# Altium schematic sheet Sheet1.SchDoc (part 2 of 2)
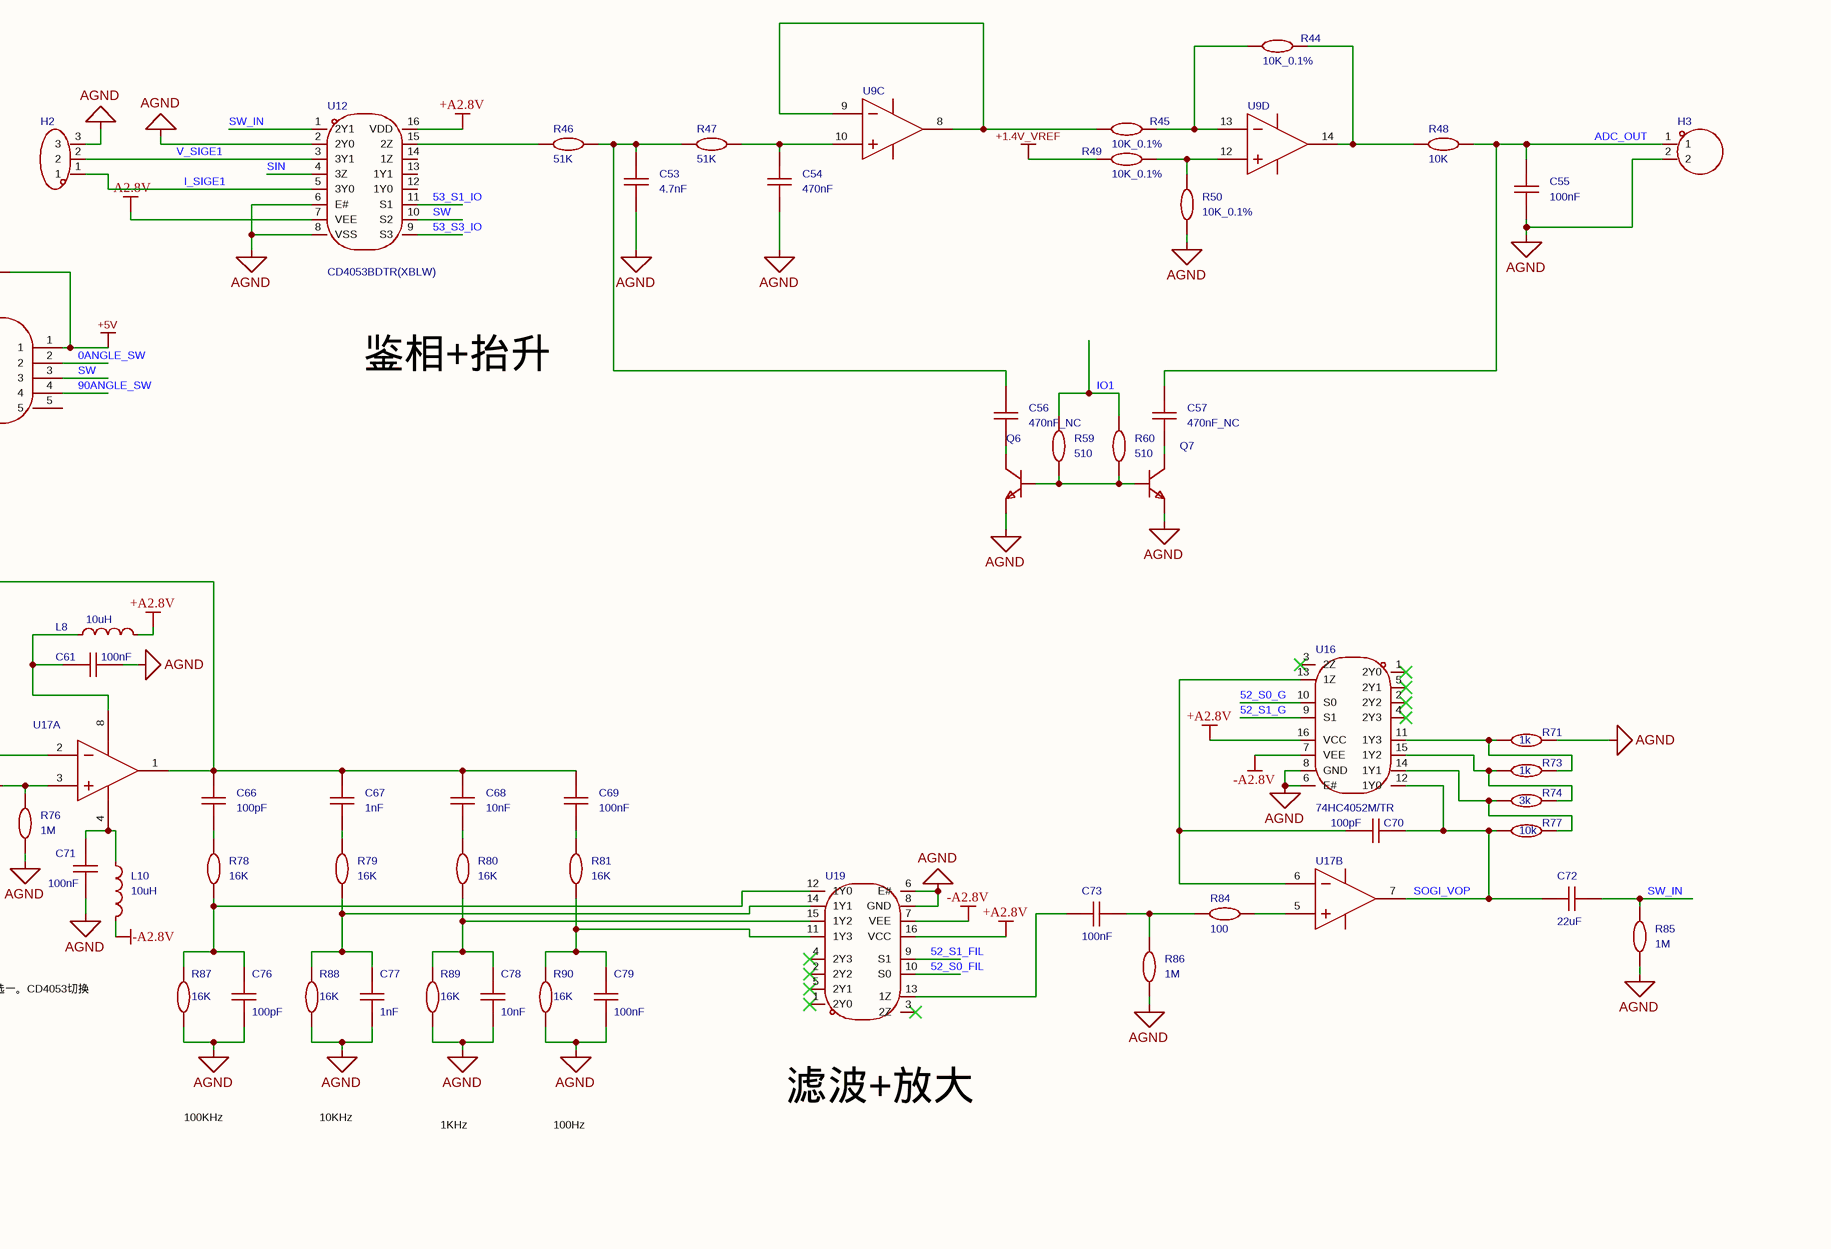
[diagram p8: Sheet1.SchDoc, row 4 of 4 right]

## Library data of the parts
BAT1 P1 = XH2.54直插座-2P: AddInBom: yes; ModelId: dc9654a6caad4c20aab3bc231ea458cf; ModelTransform: 296.889,230.315,0,0,0,0,0,26.653,-137.795; Symbol: XH2.54直插座-2P; Device: XH2.54直插座-2P; LCSC Part Name: XH2.54直插座-2P; SupplierPart: C9900016957; ManufacturerPart: XH2.54直插座-2P; Supplier Footprint: XH2.54-2; JLCPCB Part Class: 扩展库; Supplier: LCSC; ConvertToPcb: yes; FootprintName: CONN-TH_XH2.54-2P; ModelName: CONN-TH_XH2.54-2P
BUZZER1 = TMB12A05_C96093: 驱动方式:有源(内含驱动线路);构造类型:电磁式;额定电压:-;频率:2.4kHz;声压(SPL):85dB;; Manufacturer: 华能; AddInBom: yes; ModelId: 16ab50e14c5b4f2c986c135bdba60e37; ModelName: BUZ-TH_D12.0-H9.5-P7.60; ModelTransform: 472.44,472.176,0,90,0,0,-0.787,0,-177.165; Voltage - Supply: 4V~8V; Sound Pressure Level(SPL): 85dB; Symbol: TMB12A05; Device: TMB12A05_C96093; LCSC Part Name: TMB12A05; SupplierPart: C96093; ManufacturerPart: TMB12A05; Supplier Footprint: 插件,D=12mm; JLCPCB Part Class: 扩展库; Datasheet: https://atta.szlcsc.com/upload/public/pdf/source/20241025/8A17FE04D767D19A35A06DEF9A82AB1E.pdf; Supplier: LCSC; ConvertToPcb: yes; FootprintName: BUZ-TH_BD12.0-P7.60-D0.6-FD; Driver Circuitry: 有源(内含驱动线路); Technology: 电磁式; Voltage Rating: -; Current Consumption: -; Diameter(φD): 12mm; Length: -; Width: -; Height: 9.8mm; Operating Temperature: -
C1-C8 C10-C19 C25 C40 C41 C44 C46-C48 C53-C57 C61 C65-C73 C76-C79 = CAP_0603: ConvertToPcb: yes; SymbolName: CapAcitance; ModelId: ac125912035d415993ca9572d50418b1; ModelName: C0603_L1.6-W0.8-H0.8; ModelTransform: 62.992,31.496,0,0,0,0,0,0,0; Device: CAP_0603; AddInBom: yes; Supplier Footprint: 0603
  C1 C3: Value: 10uF; FootprintName: C0805
  C2: FootprintName: C0603; Value: 100nF
  C4-C8 C10-C19 C25 C40 C41 C44 C46-C48 C53-C57 C61 C65-C71 C73 C76-C79: FootprintName: C0603
  C72: FootprintName: C0805
C9 C20-C23 C26 C42 C43 C45 = CAP_0805: ConvertToPcb: yes; SymbolName: CapAcitance; ModelId: 1ba041120af144c991958decab20d241; ModelName: C0805_L2.0-W1.3-H1.3; ModelTransform: 78.74,51.181,0,0,0,0,0,0.0005,0; Device: CAP_0805; AddInBom: yes; Supplier Footprint: 0805
  C9 C20 C26 C42 C43 C45: FootprintName: C0805
  C21-C23: FootprintName: C0603
C24 = KNH2220UF35V149EC0049: 容值:220uF;精度:±20%;额定电压:35V;纹波电流:1.7A@100kHz;等效串联电阻:40mΩ@100kHz;; Manufacturer: KNSCHA(科尼盛); AddInBom: yes; ModelId: fd7be3432f664311809e69e3b3557c13; ModelTransform: 314.96,315.3537,0,90,0,0,0,0,-196.85; Tolerance: ±20%; Rated Voltage: 35V; φD: 8mm; L: 9mm; Lifetime @ Temp: 2000hrs@105℃; Symbol: KNH2220UF35V149EC0049; Device: KNH2220UF35V149EC0049; LCSC Part Name: 220uF ±20% 35V; SupplierPart: C2981462; ManufacturerPart: KNH2220UF35V149EC0049; Supplier Footprint: 插件,D8xL9mm; JLCPCB Part Class: 扩展库; Datasheet: https://atta.szlcsc.com/upload/public/pdf/source/20220426/9FC8A158D93B909CC105160B4A0CB698.pdf; Supplier: LCSC; ConvertToPcb: yes; FootprintName: CAP-TH_BD8.0-P3.50-D0.6-FD-2; ModelName: CAP-TH_BD8.0-P3.50-D0.6-FD-2; Ripple Current: 1.7A@100kHz; Equivalent Series Resistance(ESR): 40mΩ@100kHz; Lead Spacing: 3.5mm; Operating Temperature: -55℃~+105℃
C27-C39 = 104: 贴片电容/MLCC电容; Origin Footprint: C0603_M; Symbol: C; BOM名称: 无极性贴片电容; 联系卖家，免费查找封装: 唯一出售店铺网址https://shop463601444.taobao.com; AddInBom: yes; Device: 104; Design Item ID: C; Library Name: 0.1 - 电阻-电容-电感-晶振-晶体-磁珠-电位器-法拉电容-馈通电容; ConvertToPcb: yes
C49-C52 C58-C60 C62-C64 C74 C75 C80-C84 = CAP_0402: ConvertToPcb: yes; SymbolName: CapAcitance; ModelId: 36a51122f27c49738f86b3bfa98863e0; ModelName: C0402_L1.0-W0.5-H0.5; ModelTransform: 39.37,19.685,0,0,0,0,0,0,0; Device: CAP_0402; AddInBom: yes; Supplier Footprint: 0402; FootprintName: C0603
CE1 = 3.3uF/16V: 直插电解电容; Origin Footprint 1: C0805_M; Symbol: CE; 联系卖家，免费查找封装: 唯一出售店铺网址https://shop463601444.taobao.com; AddInBom: yes; Device: 3.3uF/16V; Design Item ID: CE; Library Name: 0.1 - 电阻-电容-电感-晶振-晶体-磁珠-电位器-法拉电容-馈通电容; BOM名称: 直插电解电容; Origin Footprint 2: C0805_M; ConvertToPcb: yes
CE2-CE5 = 22uF/16V: 直插电解电容; Origin Footprint 1: C0805_M; Symbol: CE; 联系卖家，免费查找封装: 唯一出售店铺网址https://shop463601444.taobao.com; AddInBom: yes; Device: 22uF/16V; Design Item ID: CE; Library Name: 0.1 - 电阻-电容-电感-晶振-晶体-磁珠-电位器-法拉电容-馈通电容; BOM名称: 直插电解电容; Origin Footprint 2: C0805_M; ConvertToPcb: yes
D1 D2 = SS24_C7420362: 二极管配置:独立式;正向压降(Vf):550mV@1.0A;直流反向耐压(Vr):40V;整流电流:2A;; Manufacturer: 宏迦橙; AddInBom: yes; ModelId: 7e24bebe6cd74171ae8c9de6fc5b78aa; ModelTransform: 198.4248,103.5431,0,180,0,0,0,0,0; Diode Configuration: 独立式; Reverse Voltage (Vr): 40V; Rectified Current: 2A; Reverse Leakage Current (Ir): 200uA@40V; Symbol: SS24_C7420362; Device: SS24_C7420362; LCSC Part Name: 电压:40V 电流:2A; SupplierPart: C7420362; Supplier Footprint: SMA(DO-214AC); JLCPCB Part Class: 扩展库; Datasheet: https://atta.szlcsc.com/upload/public/pdf/source/20230828/2D67628D7EFDC2DD386D167E8AEA232D.pdf; Supplier: LCSC; ConvertToPcb: yes; FootprintName: SMA_L4.3-W2.6-LS5.0-FD; ModelName: SMA_L4.3-W2.6-LS5.0-FD; Forward Voltage (Vf@If): 550mV@1.0A
D3 = FR107_C963379: 二极管配置:-;正向压降(Vf):1.3V@1A;直流反向耐压(Vr):1kV;整流电流:1A;反向恢复时间(trr):500ns;; Manufacturer: JSMSEMI(杰盛微); ManufacturerPart: FR107; AddInBom: yes; ModelId: 7884390a25fb4c08947731ebfba7e3f8; ModelTransform: 144.8816,62.992,0,0,0,0,0,0,0; Reverse Voltage (Vr): 1kV; Rectified Current: 1A; Reverse Leakage Current (Ir): 5uA@1kV; Reverse Recovery Time (trr): 500ns; Symbol: FR107_C963379; Device: FR107_C963379; LCSC Part Name: FR107; SupplierPart: C963379; Supplier Footprint: SOD-123; Datasheet: https://atta.szlcsc.com/upload/public/pdf/source/20230807/039A8781E74C9E6DBC2E128AB501E48D.pdf; Supplier: LCSC; ConvertToPcb: yes; FootprintName: SOD-123_L2.8-W1.8-LS3.7-RD; ModelName: SOD-123_L2.8-W1.8-LS3.7-RD; Diode Configuration: -; Forward Voltage (Vf@If): 1.3V@1A; Operating Temperature: -55℃~+150℃
D4 D5 = BAT54S,215: 二极管配置:1对串联式;正向压降(Vf):800mV@100mA;直流反向耐压(Vr):30V;平均整流电流(Io):200mA;; Manufacturer: Nexperia(安世); AddInBom: yes; ModelId: 89cb27a44ab2466697082bb9fd73a7d0; ModelName: SOT-23-3L_L2.9-W1.6-H1.1-LS2.8-P0.95; ModelTransform: 110.59301,114.173,0,180,0,0,0,-0.0005,0; Diode Configuration: 1对串联式; Reverse Voltage (Vr): 30V; Average Rectified Current (Io): 200mA; Reverse Leakage Current (Ir): 2uA@25V; Symbol: BAT54S,215; Device: BAT54S,215; Supplier: LCSC; Manufacturer Part: BAT54S,215; Supplier Part: C47546; JLCPCB Part Class: 扩展库; LCSC Part Name: 电压:30V 电流:200mA; Supplier Footprint: SOT-23; Datasheet: https://atta.szlcsc.com/upload/public/pdf/source/20180326/C130910_AAC331EF45C4B7D7866DD336DA3C5D86.pdf; ConvertToPcb: yes; FootprintName: SOT-23-3_L3.0-W1.7-P0.95-LS2.9-BR; Forward Voltage (Vf@If): 800mV@100mA
H1 = HDR-F_2.54_1x4P: Symbol: 2.54-1*4P母; ConvertToPcb: yes; ModelId: d187812051054f85879fcaa51a310d8e; ModelTransform: 419.6842,98.464,0,0,0,0,0,0,-118.11; Device: HDR-F_2.54_1x4P; AddInBom: yes; SupplierPart: C2718488; Supplier Footprint: 插件; FootprintName: HDR-TH_4P-P2.54-V-F; ModelName: HDR-TH_4P-P2.54-V-F
H2 = HDR-M_2.54_1x3P: Symbol: PZ254V-11-03P_C2937625; ConvertToPcb: yes; ModelId: bb473b6d38ff42a99216a4fcdbdcc4cb; ModelName: HDR-TH_3P-P2.54-M-LI-1X3P; ModelTransform: 299.9994,100,0,0,0,0,0,0,-118.11; Device: HDR-M_2.54_1x3P; AddInBom: yes; SupplierPart: C2937625; Supplier Footprint: 插件; FootprintName: HDR-TH_3P-P2.54-V-M
H3 = HDR-M_2.54_1x2P: Symbol: 210S-1*2P L=11.6MMGold-plated black; ConvertToPcb: yes; ModelId: 79b2e9f2d70a4d68a1b7098f27c6d4c5; ModelName: HDR-M-2.54_1x2; ModelTransform: 200,100,0,0,0,0,0,0,-118.11; Device: HDR-M_2.54_1x2P; AddInBom: yes; SupplierPart: C124375; Supplier Footprint: 插件; FootprintName: HDR-TH_2P-P2.54-V-M-1
H4 = HDR-M_2.54_1x5P: Symbol: MTP125-1105S1; ConvertToPcb: yes; ModelId: 47d466e4a34f4fc5bc626cf773a24dd5; ModelName: HDR-TH_5P-P2.54-M-LI-1X5P; ModelTransform: 499.999,100,0,0,0,0,0,0,-118.11; Device: HDR-M_2.54_1x5P; AddInBom: yes; SupplierPart: C358687; Supplier Footprint: 插件; FootprintName: HDR-TH_5P-P2.54-V-M
L1 L4 L5 L8 L10 = L_0603: Symbol: SDFL1608S100KTF; AddInBom: yes; ModelId: 2bc5ec593d464d6ba9807aec0b5673c2; ModelName: L0603_L1.6-W0.8-H0.5_BEAD; ModelTransform: 62.992,31.496,0,180,0,0,0.094,0.629,0; Device: L_0603; Supplier Footprint: L0603; ConvertToPcb: yes; FootprintName: L0603
L2 L6 L7 L9 L11 = BLM15AG102SN1D: 标称阻抗@测试频率:1kΩ@100MHz;误差:±25%;直流电阻(RDC):650mΩ;; Manufacturer: muRata(村田); AddInBom: yes; ModelId: d8d36575a3234d4790bfa765c88664a7; ModelName: L0402_L1.0-W0.5-H0.5_BEAD; ModelTransform: 39.37,19.685,0,0,0,0,0,0.0005,0; Tolerance: ±25%; DC Resistance: 650mΩ; Current Rating: 300mA; Circuits: 1; Device: BLM15AG102SN1D; Symbol: BLM15AG102SN1D; LCSC Part Name: 单路 0402磁珠 阻抗1kΩ@100MHz; SupplierPart: C76883; ManufacturerPart: BLM15AG102SN1D; Supplier Footprint: 0402; JLCPCB Part Class: 扩展库; Datasheet: https://atta.szlcsc.com/upload/public/pdf/source/20181120/C333978_3E581FB55966932B05020139ABDE8E01.pdf; Supplier: LCSC; ConvertToPcb: yes; FootprintName: L0603; Impedance @ Frequency: 1kΩ@100MHz
L3 = FXL0630-100-M: 电感值:10uH;精度:±20%;额定电流:4.5A;饱和电流(Isat):5.5A;类型:一体成型电感;; Manufacturer: cjiang(长江微电); AddInBom: yes; ModelId: e28854526ca747668ea12fbe1dd39a63; ModelName: IND-SMD_L7.3-W6.8-H3.0; ModelTransform: 292.125,267.716,0,0,0,0,0,0,0; Tolerance: ±20%; Rated Current: 4.5A; Saturation Current (Isat): 5.5A; DC Resistance (DCR): 68mΩ; Type: 一体成型电感; Symbol: FXL0630-100-M; Device: FXL0630-100-M; LCSC Part Name: 10uH ±20% 5.5A; SupplierPart: C167223; ManufacturerPart: FXL0630-100-M; Supplier Footprint: SMD,6.6x7mm; JLCPCB Part Class: 扩展库; Datasheet: https://atta.szlcsc.com/upload/public/pdf/source/20240426/3189EA8206330E2108542F9E34E540E7.pdf; Supplier: LCSC; ConvertToPcb: yes; FootprintName: IND-SMD_L7.3-W6.8; Ratings: -
LED1-LED6 = LED_0603-R: Symbol: LED_R; Convert to PCB: yes; 3D Model: dd8257b0d61a4cd7b68939a056e08095; 3D Model Transform: 58.72,29.4,22.03,0,0,0,0,0,0; ModelName: LED-0603_R; Device: LED_0603-R; Add into BOM: yes; Supplier Footprint: 0603; FootprintName: LED_0603
Q1 Q3 = AO3401A_P: Symbol: P_MOS; AddInBom: yes; ModelId: c62791f0466c4ae2a892c056b845b0ca; ModelName: SOT-23-3P_L2.9-W1.3-H1.0-LS2.4-P0.95; ModelTransform: 98.6,114.12,41.29,180,0,0,0,0,0; Device: AO3401A_P; Supplier Footprint: SOT-23-3L; ConvertToPcb: yes; FootprintName: AO3401A_SOT-23-3; SupplierPart: C15127
Q2 Q6 Q7 = S8050_SOT_NPN: ConvertToPcb: yes; SymbolName: NPN; ModelId: c62791f0466c4ae2a892c056b845b0ca; ModelName: SOT-23-3P_L2.9-W1.3-H1.0-LS2.4-P0.95; ModelTransform: 98.6,114.12,41.29,180,0,0,0,0,-3; Device: S8050_SOT_NPN; AddInBom: yes; Supplier Footprint: SOT-23; FootprintName: S8050_SOT-23
Q4 = AO3400A_N: 类型:N沟道;漏源电压(Vdss):30V;连续漏极电流(Id):5.2A;功率(Pd):1W;导通电阻(RDS(on)@Vgs,Id):35mΩ@10V,5A;阈值电压(Vgs(th)@Id):1.5V@250μA;; Symbol: N_MOS; AddInBom: yes; ModelId: c62791f0466c4ae2a892c056b845b0ca; ModelName: SOT-23-3P_L2.9-W1.3-H1.0-LS2.4-P0.95; ModelTransform: 98.425,114.173,0,180,0,0,0.0005,-0.0005,0; Device: AO3400A_N; Supplier Footprint: SOT-23; ConvertToPcb: yes; FootprintName: SOT-23-3_L2.9-W1.3-P1.90-LS2.4-BR; SupplierPart: C700953
Q5 = AO3400A_C20917: 类型:1个N沟道;漏源电压(Vdss):30V;连续漏极电流(Id):5.7A;导通电阻(RDS(on)@Vgs,Id):26.5mΩ@10V,5.7A;功率(Pd):1.4W;阈值电压(Vgs(th)@Id):1.5V@250uA;; Manufacturer: AOS; AddInBom: yes; ModelId: c62791f0466c4ae2a892c056b845b0ca; ModelName: SOT-23-3P_L2.9-W1.3-H1.0-LS2.4-P0.95; ModelTransform: 98.425,114.173,0,180,0,0,0.0005,-0.0005,0; Type: 1个N沟道; Drain Source Voltage (Vdss): 30V; Power Dissipation (Pd): 1.4W; Total Gate Charge (Qg@Vgs): 7nC@4.5V; Input Capacitance (Ciss@Vds): 630pF@15V; Symbol: AO3400A; Device: AO3400A_C20917; LCSC Part Name: 1个N沟道 耐压:30V 电流:5.7A; SupplierPart: C20917; ManufacturerPart: AO3400A; Supplier Footprint: SOT-23-3L; Datasheet: https://atta.szlcsc.com/upload/public/pdf/source/20140107/1457706668533.pdf; Supplier: LCSC; ConvertToPcb: yes; FootprintName: SOT-23-3_L2.9-W1.3-P1.90-LS2.4-BR; Continuous Drain Current (Id): 5.7A; Drain Source On Resistance (RDS(on)@Vgs,Id): 26.5mΩ@10V,5.7A; Gate Threshold Voltage (Vgs(th)@Id): 1.5V@250uA; Operating Temperature: -55℃~+150℃@(Tj)
R1-R11 R13 R16 R17 R19 R22 R24-R102 = Res_0603: Symbol: 电阻; ConvertToPcb: yes; ModelId: fc143cca1e79419f9cd78b61e9279f08; ModelTransform: 31.8897,63.7794,0,90,0,0,0,0,0; Device: Res_0603; AddInBom: yes; Supplier Footprint: 0603; FootprintName: R0603; ModelName: R0603
R12 R20 R21 = Res_0603: Convert to PCB: yes; Symbol: 电阻; ModelId: fc143cca1e79419f9cd78b61e9279f08; ModelTransform: 31.8897,63.7794,0,90,0,0,0,0,0; Add into BOM: yes; Device: Res_0603; Supplier Footprint: 0603; FootprintName: R0603; ModelName: R0603
R14 R15 R18 R23 = Res_0805: Symbol: 电阻; ConvertToPcb: yes; ModelId: 37a81e68749a4138bd2dfa6897b24b85; ModelName: R0805_L2.0-W1.3-H0.6; ModelTransform: 78.74,51.181,0,0,0,0,0,-0.0005,0; Device: Res_0805; AddInBom: yes; Supplier Footprint: 0805; FootprintName: R0603
SCREW1-SCREW4 = M3螺丝: ConvertToPcb: yes; SymbolName: 螺丝孔; Device: M3螺丝; AddInBom: yes; Supplier Footprint: 插件; FootprintName: M3螺丝
SW1 = Key_SMD_3.6x6.1x2.5: SymbolName: 轻触按键x2; AddInBom: yes; ModelId: 90d18ad19a7e424ebd3215e1b5dcb80c聨0819f05c4eef4c71ace90d822a990e87; ModelName: KEY-SMD_2P-L6.0-W3.6-H2.5-LS8.0 COPY; ModelTransform: 311.02,141.73,102.36,0,0,0,0,0,0; Device: Key_SMD_3.6x6.1x2.5; ConvertToPcb: yes; FootprintName: Key_SMD_3.6x6.1x2.5; Supplier Footprint: SMD
SW2-SW5 = Key_TH_6x6x6: 触点电流:50mA;额定电压(DC):12V;绝缘电阻:100MΩ;电路结构:单刀单掷;安装方式:直插;按钮形状:圆形按钮;按钮/盖帽颜色:黑色;作用力:260gf@±30gf;工作温度:-25℃~+70℃;引脚样式:PC引脚;开关长度:6mm;开关宽度:6mm;开关高度:6mm;带支架:否;; Symbol: 轻触按键; ConvertToPcb: yes; ModelId: 20eee248bc684ccd8cbdbb1d0d91ec6f; ModelName: SW-TH_4P-L6.0-W6.0-H5.0-LS6.5-P4.50; ModelTransform: 236.22,323.03,0,90,0,0,0,0,-137.795; Device: Key_TH_6x6x6; AddInBom: yes; SupplierPart: C2837516; Supplier Footprint: 插件; FootprintName: SW-TH_4P-L6.0-W6.0-P4.50-LS6.5
SW6 = XKB7070-Z: 自锁/无锁:自锁;安装方式:直插;触点电流:100mA;额定电压 (AC):250V;额定电压 (DC):30V;带灯:不带;作用力:160gf;机械寿命:10万次;; Manufacturer: XKB Connectivity(中国星坤); AddInBom: yes; ModelId: 65f5674ceb7247f197b01bc7adea0d8f; ModelTransform: 275.59,275.629,0,0,0,0,0,0,-137.795; Self Lock / No Lock: 自锁; Actuator Style: 矩形按钮; Contact Current: 100mA; Voltage Rating (AC): 250V; Voltage Rating (DC): 30V; Insulation Resistance: 100MΩ; Actuator/Cap Color: 蓝色; With Lamp: 不带; Pin Style: PC引脚; Operating Force: 160gf; Mechanical Life: 10万次; Symbol: XKB7070-Z; Device: XKB7070-Z; LCSC Part Name: 按键开关   7*7插件自锁 蓝白黑; SupplierPart: C318863; ManufacturerPart: XKB7070-Z; Supplier Footprint: 插件; JLCPCB Part Class: 扩展库; Datasheet: https://atta.szlcsc.com/upload/public/pdf/source/20211015/75A682A27A424BDE8D93C2CFA14C38FE.pdf; Supplier: LCSC; ConvertToPcb: yes; FootprintName: SW-TH_6P-L7.0-W7.0-P2.00; ModelName: SW-TH_6P-L7.0-W7.0-P2.00; IP Rating: -; Mounting Style: 直插; Operating Temperature: -15℃~+55℃
U1 U17 = RS8752XM: 放大器数:双路;增益带宽积(GBP):250MHz;输入偏置电流(Ib):1pA;输入失调电压(Vos):1.5mV;压摆率(SR):180V/us;带宽(-3db):250MHz;; Manufacturer: RUNIC(润石); Relevance: []; AddInBom: yes; ModelId: 1de5a054e9244f539c6db8238d445f94; ModelTransform: 118.11,196.85,0,0,0,0,0,0,0; Number of Circuits: 双路; Gain Bandwidth Product(GBP): 250MHz; Current - Input Bias(Ib): 1pA; Voltage - Input Offset(Vos): 1.5mV; Supply Current: 2.9mA; Symbol: RS8752XM; Device: RS8752XM; LCSC Part Name: 高速运放RS8752XM; SupplierPart: C255421; ManufacturerPart: RS8752XM; Supplier Footprint: MSOP-8; JLCPCB Part Class: 扩展库; Datasheet: https://atta.szlcsc.com/upload/public/pdf/source/20180801/C255422_28B98AAAFB3A51C5B40B4289640087D6.pdf; Supplier: LCSC; ConvertToPcb: yes; FootprintName: MSOP-8_L3.0-W3.0-P0.65-LS5.0-BL; ModelName: MSOP-8_L3.0-W3.0-P0.65-LS5.0-BL; Slew Rate(SR): 180V/us; -3db Bandwidth: 250MHz
U2 U14 U16 U19 U20 = 74HC4052M/TR: Manufacturer: HGSEMI(华冠); AddInBom: yes; ModelId: ed96d47c1e844792b3e705d722a1a1fa; ModelTransform: 389.763,236.22,0,0,0,0,0,0,0; Device: 74HC4052M/TR; LCSC Part Name: 高速 CMOS 差分 4 通道模拟多路复用器和多路信号分离器; SupplierPart: C507179; ManufacturerPart: 74HC4052M/TR; Supplier Footprint: SOP-16; JLCPCB Part Class: 扩展库; Datasheet: https://atta.szlcsc.com/upload/public/pdf/source/20200402/C507179_EDEF75F06BD662FE8D3145782CF64ACB.pdf; Supplier: LCSC; ConvertToPcb: yes; SymbolName: 74HC4052M/TR; FootprintName: SOP-16_L10.0-W3.9-P1.27-LS6.0-BL; ModelName: SOP-16_L9.9-W3.9-P1.27-LS6.0-BL
U3 = AD9833BRMZ-REEL7_C9652: 电源电压:2.3V~5.5V;分辨率(位):10;自宽调谐(最大值):28b;; Manufacturer: ADI(亚德诺); AddInBom: yes; ModelId: b42a31f9e1fa4643bc7ea573b9bba7ed; ModelName: MSOP-10_L3.0-W3.0-H1.1-LS5.0-P0.50; ModelTransform: 118.11,196.85,0,0,0,0,0,0,0; Resolution (Bits): 10; Tuning  Word Width(Max): 28b; The main FCLK: 25MHz; Symbol: AD9833BRMZ; Device: AD9833BRMZ-REEL7_C9652; LCSC Part Name: AD9833低功耗DDS设备; SupplierPart: C9652; ManufacturerPart: AD9833BRMZ-REEL7; Supplier Footprint: MSOP-10; JLCPCB Part Class: 扩展库; Datasheet: https://atta.szlcsc.com/upload/public/pdf/source/20121029/1457706544172.pdf; Supplier: LCSC; ConvertToPcb: yes; FootprintName: MSOP-10_L3.0-W3.0-P0.50-LS5.0-BL; Supply Voltage: 2.3V~5.5V; Operating Temperature: -40℃~+85℃
U4 = STC32G12K128-35I-LQFP48: Manufacturer: STC; AddInBom: yes; ModelId: 093be70396ff421eb2cdb946d5311efc; ModelName: LQFP-48_L7.0-W7.0-H1.4-LS9.0-P0.50; ModelTransform: 354.331,354.331,0,0,0,0,0,0,0; Symbol: STC32G12K128-35I-LQFP48; Device: STC32G12K128-35I-LQFP48; LCSC Part Name: STC32G12K128-35I-LQFP48; SupplierPart: C5210760; ManufacturerPart: STC32G12K128-35I-LQFP48; Supplier Footprint: LQFP-48(7x7); JLCPCB Part Class: 扩展库; Datasheet: https://atta.szlcsc.com/upload/public/pdf/source/20241226/E8981118341CB9C62D3D58EFD7554832.pdf; Supplier: LCSC; ConvertToPcb: yes; FootprintName: LQFP-48_L7.0-W7.0-P0.50-LS9.0-BL
U5 = CH340N: Manufacturer: WCH(南京沁恒); Symbol: CH340N_C2977777; AddInBom: yes; ModelId: 75c24a7891ee4dd6bdac16a7163ff87e; ModelName: SOP-8_L4.9-W3.9-P1.27-LS6.0-BL-1; ModelTransform: 192.913,236.22,0,0,0,0,0,0,0; Device: CH340N; LCSC Part Name: USB转串口芯片 CH340; SupplierPart: C2977777; ManufacturerPart: CH340N; Supplier Footprint: SOP-8; JLCPCB Part Class: 扩展库; Datasheet: https://atta.szlcsc.com/upload/public/pdf/source/20230530/6E401E9554E9F5311886CC8B3F89B62E.pdf; Supplier: LCSC; ConvertToPcb: yes; FootprintName: SOP-8_L4.9-W3.9-P1.27-LS6.0-BL
U6 = TP4056-42-ESOP8: 锂电池充电芯片 42代表电池满电电压4.2V。; Manufacturer: TOPPOWER(南京拓微); Symbol: TP4056; AddInBom: yes; ModelId: d3e00daa36c445139c055a3b9efb85d2; ModelName: ESOP-8_L4.9-W3.9-H1.6-LS6.0-P1.27; ModelTransform: 240.157,192.913,0,90,0,0,0,0,0; Device: TP4056-42-ESOP8; LCSC Part Name: TP4056-42-ESOP8; SupplierPart: C16581; ManufacturerPart: TP4056-42-ESOP8; Supplier Footprint: ESOP-8; JLCPCB Part Class: 扩展库; Datasheet: https://atta.szlcsc.com/upload/public/pdf/source/20190626/C16581_611BCF5D7CF554EAE465137A8F68DB3E.pdf; Supplier: LCSC; ConvertToPcb: yes; FootprintName: ESOP-8_L4.9-W3.9-P1.27-LS6.0-BL-EP
U7 = RT9193: Origin Footprint: SOT23-5; AddInBom: yes; Device: RT9193; Symbol: RT9193; Design Item ID: RT9193; Library Name: MXT; ConvertToPcb: yes
U8 = SGM3204: Origin Footprint: SOT23-6; AddInBom: yes; Device: SGM3204; Symbol: SGM3204; Design Item ID: SGM3204; Library Name: MXT; ConvertToPcb: yes
U9 = RS8554XQ: 放大器数:四路;增益带宽积(GBP):4.5MHz;压摆率(SR):2.7V/us;; Manufacturer: RUNIC(润石); Relevance: []; AddInBom: yes; ModelId: 02f1f60386074b2ca8e111040ac061f2; ModelName: TSSOP-14_L5.0-W4.4-H1.0-LS6.4-P0.65; ModelTransform: 237.007,196.85,0,90,0,0,0,0,0; Number of Circuits: 四路; Gain Bandwidth Product(GBP): 4.5MHz; Supply Voltage: 2.7V~5.5V; Symbol: RS8554XQ; Device: RS8554XQ; LCSC Part Name: 精密运放RS8554XQ; SupplierPart: C255429; ManufacturerPart: RS8554XQ; Supplier Footprint: TSSOP-14; JLCPCB Part Class: 扩展库; Datasheet: https://atta.szlcsc.com/upload/public/pdf/source/20180801/C255431_5DFA0183D1ACA7F14A60743D93152121.pdf; Supplier: LCSC; ConvertToPcb: yes; FootprintName: TSSOP-14_L5.0-W4.4-P0.65-LS6.4-BL; Slew Rate(SR): 2.7V/us; Operating Temperature: -40℃~+125℃
U10 = SX1308: 功能类型:升压型;输出类型:可调;工作电压:2V~24V;输出电压:28V;输出电流:2A;; Manufacturer: SX(硕芯科技); AddInBom: yes; ModelId: 18da8f6c14a34920b3e136b5c401a119; ModelName: SOT-23-6_L2.9-W1.6-H1.5-LS2.8-P0.95; ModelTransform: 110.236,113.364,0,90,0,0,0.0005,0.0005,0; Function: 升压型; Output Type: 可调; Voltage - Supply: 2V~24V; Output Voltage: 28V; Output Current: 2A; Frequency - Switching: 1.2MHz; Synchronous Rectifier: 否; Number of Outputs: 1; Topology: 升压式; Quiescent Current: 100uA; Switch tube (built-in/external): 内置; Symbol: SX1308; Device: SX1308; LCSC Part Name: 高效1.2MHz 2A升压转换器; SupplierPart: C78162; ManufacturerPart: SX1308; Supplier Footprint: SOT-23-6; JLCPCB Part Class: 扩展库; Datasheet: https://atta.szlcsc.com/upload/public/pdf/source/20160920/1474356679185.pdf; Supplier: LCSC; ConvertToPcb: yes; FootprintName: SOT-23-6_L2.9-W1.6-P0.95-LS2.8-BL; Operating Temperature: -40℃~+85℃
U11 U18 = RS8554XP: 放大器数:四路;增益带宽积(GBP):4.5MHz;输入偏置电流(Ib):1pA;压摆率(SR):2.7V/us;轨到轨:-;; Manufacturer: RUNIC(润石); AddInBom: yes; ModelId: 8dbf5b715d42428c85558507ae5a252b; ModelName: SOIC-14_L8.6-W3.9-H1.8-LS6.0-P1.27; ModelTransform: 338.583,236.22,0,0,0,0,0,-0.001,0; Number of Circuits: 四路; Gain Bandwidth Product(GBP): 4.5MHz; Current - Input Bias(Ib): 1pA; Supply Voltage: 2.7V~5.5V; Output Current: 50mA; Symbol: RS8554XP; Device: RS8554XP; LCSC Part Name: RS8554XP; SupplierPart: C236997; ManufacturerPart: RS8554XP; Supplier Footprint: SOIC-14; JLCPCB Part Class: 扩展库; Datasheet: https://atta.szlcsc.com/upload/public/pdf/source/20180704/C236997_BF74C37E35A725D699BA91BFBED4064A.pdf; Supplier: LCSC; ConvertToPcb: yes; FootprintName: TSSOP-14_L5.0-W4.4-P0.65-LS6.4-BL; Slew Rate(SR): 2.7V/us; Output Type: -; Rail to Rail: -; Operating Temperature: -40℃~+125℃
U12 = CD4053BDTR(XBLW): 导通电阻(Ron@VCC):350Ω;; Manufacturer: XBLW(芯伯乐); AddInBom: yes; ModelId: ed96d47c1e844792b3e705d722a1a1fa; ModelTransform: 389.763,236.22,0,0,0,0,0,0,0; Supply Voltage: 3V~9V; On-State Resistance (Max): 350Ω; Symbol: CD4053BDTR(XBLW); Device: CD4053BDTR(XBLW); LCSC Part Name: CD4053BDTR(XBLW); SupplierPart: C19708120; ManufacturerPart: CD4053BDTR(XBLW); Supplier Footprint: SOP-16; JLCPCB Part Class: 扩展库; Datasheet: https://atta.szlcsc.com/upload/public/pdf/source/20231215/0C9D8E7420B1DBE63C1B545CF8B3B4AB.pdf; Supplier: LCSC; ConvertToPcb: yes; FootprintName: SOP-16_L9.9-W3.9-P1.27-LS6.0-BL; ModelName: SOP-16_L9.9-W3.9-P1.27-LS6.0-BL; Operating Temperature: -40℃~+85℃
U13 = GAQY211G2S: 触点形式:-;适用负载类型:-;正向压降(Vf):1.2V;负载电压:40V;连续负载电流:2.5A;导通电阻:60mΩ;; Manufacturer: SUPSiC(国晶微半导体); AddInBom: yes; ModelId: 7a816c7b730e4b8989440f8e2ea085d3; ModelName: SOP-4_L4.0-W4.4-H2.1-LS7.0-P2.54; ModelTransform: 157.48,275.591,0,90,0,0,0,0,0; Input Forward Voltage: 1.2V; Voltage - Load: 40V; Continuous Load Current: 2.5A; On Resistance: 60mΩ; Isolation Voltage(rms): 2.5kV; Turn-on time: 800us; Turn-off time: 20us; Symbol: GAQY211G2S; Device: GAQY211G2S; LCSC Part Name: GAQY211G2S 1 Form A(SPST-NO) 负载电压:40V 连续负载电流:2.5A; SupplierPart: C7435104; ManufacturerPart: GAQY211G2S; Supplier Footprint: SOP-4; JLCPCB Part Class: 扩展库; Datasheet: https://atta.szlcsc.com/upload/public/pdf/source/20241011/4BAA9F2B28F4E3269CE00069A12AE23B.pdf; Supplier: LCSC; ConvertToPcb: yes; FootprintName: SOP-4_L4.4-W4.0-P2.54-LS7.0-TL; Relay Contact Form: -; Load Type: -
U15 = hfd31/5: AddInBom: yes; Device: hfd31/5; ConvertToPcb: yes; SymbolName: hfd31/5; FootprintName: hfd31/5
USBC1 = TYPE-C-31-M-12: 连接器类型:Type-C;标准:-;公母:母;安装方式:-;触点数量:16P;端口数量:1;额定电流 - 电源:5A;工作温度范围:-;; Manufacturer: 韩国韩荣; AddInBom: yes; ModelId: 35058e297fd54ee2afd2de30c3ce7155; ModelTransform: 351.9678,311.023,0,180,0,0,0,-45.041,-39.37; Connector Type: Type-C; Gender: 母; Number of Contacts: 16P; Number of Ports: 1; Current Rating - Power (Max): 5A; Symbol: TYPE-C-31-M-12; Device: TYPE-C-31-M-12; LCSC Part Name: Type-C 母; SupplierPart: C165948; ManufacturerPart: TYPE-C-31-M-12; Supplier Footprint: SMD; JLCPCB Part Class: 扩展库; Datasheet: https://atta.szlcsc.com/upload/public/pdf/source/20220525/466408E853115E789EDB0DDC29077C05.pdf; Supplier: LCSC; ConvertToPcb: yes; FootprintName: USB-C_SMD-TYPE-C-31-M-12; ModelName: USB-C_SMD-TYPE-C-31-M-12; Standard: -; Mounting Style: -; Operating Temperature Range: -
X1 = OT322525MJBA4SL: 频率:25MHz;常温频差:±10ppm;输出模式:CMOS;工作电压:1.8V~3.3V;工作电流:5mA;频率稳定度:±20ppm;; Manufacturer: YXC(扬兴晶振); AddInBom: yes; ModelId: ae22b8d143894765bc8100c37cb6356f; ModelName: OSC-SMD_4P-L3.2-W2.5-H1.0; ModelTransform: 125.984,98.425,0,0,0,0,0,0,0; Normal temperature Frequency Tolerance: ±10ppm; Output Type: CMOS; Current - Supply: 5mA; Frequency Stability: ±20ppm; Symbol: OT322525MJBA4SL; Device: OT322525MJBA4SL; LCSC Part Name: 25MHz ±10ppm 1.8V~3.3V YSO110TR; SupplierPart: C669088; ManufacturerPart: OT322525MJBA4SL; Supplier Footprint: SMD3225-4P; JLCPCB Part Class: 扩展库; Datasheet: https://atta.szlcsc.com/upload/public/pdf/source/20240731/596E5F7673E50DA744B7F79F139FB8DF.pdf; Supplier: LCSC; ConvertToPcb: yes; FootprintName: OSC-SMD_4P-L3.2-W2.5-BL; Voltage - Supply: 1.8V~3.3V; Operating Temperature: -40℃~+85℃
X2 = X49SM8MSD2SC: 晶振类型:贴片晶振;频率:8MHz;常温频差:±20ppm;外接负载电容:20pF;频率稳定度(全温):±30ppm;; Manufacturer: YXC(扬兴晶振); AddInBom: yes; ModelId: 6f569b91267b44029b8615eb5c810fba; ModelName: HC-49S_L11.4-W1.8-H3.0-LS12.7; ModelTransform: 499.999,188.976,0,180,0,0,0.002,-0.002,0; Crystal Type: 贴片晶振; Normal temperature Frequency Tolerance: ±20ppm; External load capacitor: 20pF; Frequency Stability(Full temperature range): ±30ppm; Symbol: X49SM8MSD2SC; Device: X49SM8MSD2SC; LCSC Part Name: 8MHz ±20ppm 20pF; ManufacturerPart: X49SM8MSD2SC; Supplier Footprint: HC-49S-SMD; JLCPCB Part Class: 基础库; Datasheet: https://atta.szlcsc.com/upload/public/pdf/source/20240329/3EBF42EBCAB50CA65B6FA9D7CFA1955A.pdf; Supplier: LCSC; ConvertToPcb: yes; FootprintName: CRYSTAL-SMD_L11.5-W4.8-LS12.7; Operating Temperature: -20℃~+70℃